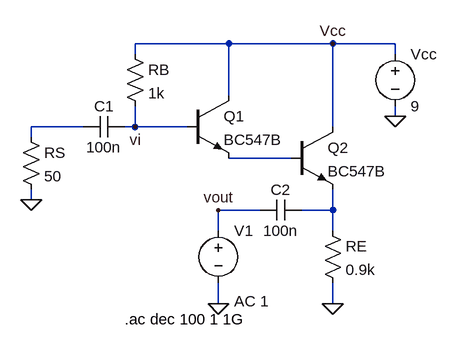
[diagram p0: schematic Zoa.asc]
Zoa.asc, the LTspice schematic file:
Version 4
SHEET 1 880 680
WIRE 176 32 32 32
WIRE 336 32 176 32
WIRE 432 32 336 32
WIRE 32 48 32 32
WIRE 432 48 432 32
WIRE 176 112 176 32
WIRE 432 144 432 128
WIRE -48 160 -128 160
WIRE 32 160 32 128
WIRE 32 160 16 160
WIRE 112 160 32 160
WIRE 336 160 336 32
WIRE -128 176 -128 160
WIRE 272 208 176 208
WIRE -128 272 -128 256
WIRE 224 288 160 288
WIRE 336 288 336 256
WIRE 336 288 288 288
WIRE 160 320 160 288
WIRE 336 320 336 288
WIRE 160 432 160 400
WIRE 336 432 336 400
FLAG 432 144 0
FLAG 336 432 0
FLAG 336 32 Vcc
FLAG 160 432 0
FLAG 32 160 vi
FLAG 160 288 vout
FLAG -128 272 0
SYMBOL npn 112 112 R0
SYMATTR InstName Q1
SYMATTR Value BC547B
SYMBOL npn 272 160 R0
SYMATTR InstName Q2
SYMATTR Value BC547B
SYMBOL res 16 32 R0
SYMATTR InstName RB
SYMATTR Value 1k
SYMBOL voltage 432 32 R0
WINDOW 123 0 0 Left 0
WINDOW 39 0 0 Left 0
SYMATTR InstName Vcc
SYMATTR Value 9
SYMBOL res 320 304 R0
SYMATTR InstName RE
SYMATTR Value 0.9k
SYMBOL cap 288 272 R90
WINDOW 0 0 32 VBottom 2
WINDOW 3 32 32 VTop 2
SYMATTR InstName C2
SYMATTR Value 100n
SYMBOL cap 16 144 R90
WINDOW 0 0 32 VBottom 2
WINDOW 3 32 32 VTop 2
SYMATTR InstName C1
SYMATTR Value 100n
SYMBOL res -144 160 R0
SYMATTR InstName RS
SYMATTR Value 50
SYMBOL voltage 160 304 R0
WINDOW 123 24 124 Left 2
WINDOW 39 0 0 Left 0
SYMATTR Value2 AC 1
SYMATTR InstName V1
SYMATTR Value ""
TEXT 16 456 Left 2 !.ac dec 100 1 1G

The netlist it stands for:
* Zoa.asc
Q1 Vcc vi N002 0 BC547B
Q2 Vcc N002 N003 0 BC547B
RB Vcc vi 1k
Vcc Vcc 0 9
RE N003 0 0.9k
C2 N003 vout 100n
C1 vi N001 100n
RS N001 0 50
V1 vout 0 AC 1
.model NPN NPN
.model PNP PNP
.lib standard.bjt
.ac dec 100 1 1G
.backanno
.end